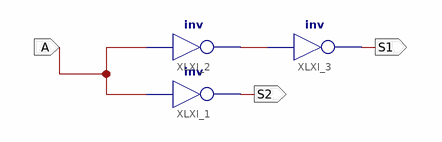
[diagram p0: schematic sheet 1]
// Xilinx ISE schematic ex01.sch (artix7) as structural Verilog: 3 symbols, 3 ports
module ex01 (
  input  A,
  output S2,
  output S1
);

  wire XLXN_3;

  not XLXI_1 (S2, A);
  not XLXI_2 (XLXN_3, A);
  not XLXI_3 (S1, XLXN_3);
endmodule
